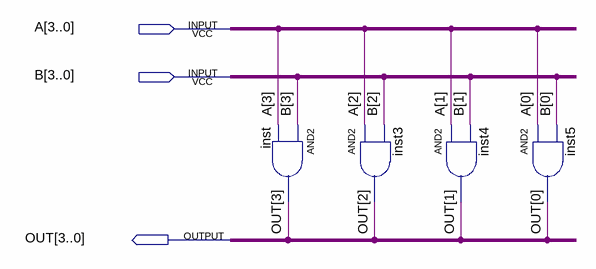
[diagram p0: schematic sheet]
// Quartus schematic AandB.bdf as structural Verilog: 4 symbols, 3 pins
module AandB (
  input  [3:0] A,
  input  [3:0] B,
  output [3:0] OUT
);

  and inst (OUT[3], B[3], A[3]);
  and inst3 (OUT[2], A[2], B[2]);
  and inst4 (OUT[1], A[1], B[1]);
  and inst5 (OUT[0], A[0], B[0]);
endmodule
